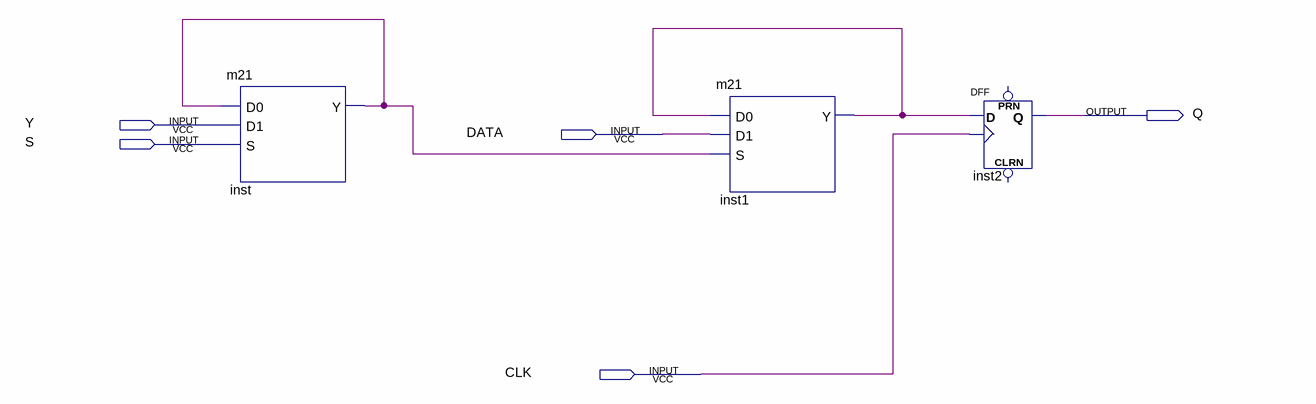
[diagram p0: schematic sheet]
// Quartus schematic TestingForRegister.bdf as structural Verilog: 3 symbols, 5 pins
module TestingForRegister (
  input  Y,
  input  DATA,
  input  S,
  input  CLK,
  output Q
);

  wire inst1_y, inst_y;

  m21 inst (.D0(inst_y), .D1(Y), .S(S), .Y(inst_y));
  m21 inst1 (.D0(inst1_y), .D1(DATA), .S(inst_y), .Y(inst1_y));
  DFF inst2 (.CLK(CLK), .D(inst1_y), .Q(Q));  // open: CLRN, PRN
endmodule
